# EAGLE design turntable (EAGLE 8.3.2)
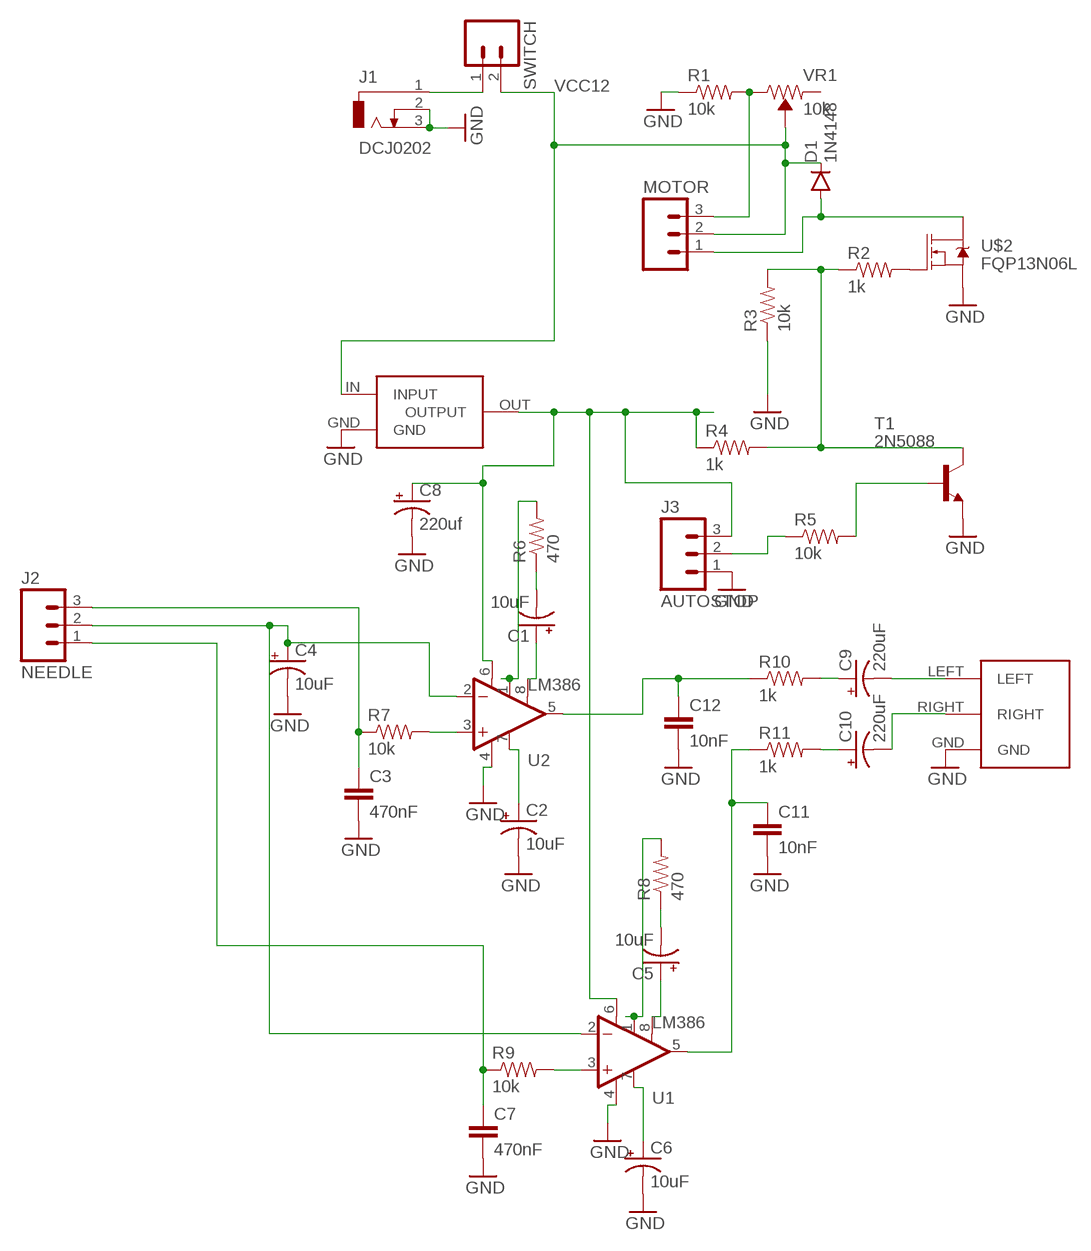
[diagram p0: schematic, sheet 1]

## Parts
C1  10uF  CPOL-USE5-5  [E5-5]
C2  10uF  CPOL-USE5-5  [E5-5]
C3  470nF  C15/8  [C15B8]
C4  10uF  CPOL-USE5-5  [E5-5]
C5  10uF  CPOL-USE5-5  [E5-5]
C6  10uF  CPOL-USE5-5  [E5-5]
C7  470nF  C15/8  [C15B8]
C8  220uf  CPOL-USTT5D10  [TT5D10]
C9  220uF  CPOL-USE5-5  [E5-5]
C10  220uF  CPOL-USE5-5  [E5-5]
C11  10nF  C5/2.5  [C5B2.5]
C12  10nF  C5/2.5  [C5B2.5]
D1  1N4148  DIODE1N4148  [DIODE-1N4148]
J1  DCJ0202  [DCJ0202]
J2  NEEDLE  M03PTH  [1X03]
J3  AUTOSTOP  M03PTH  [1X03]
MOTOR  M03PTH  [1X03]
R1  10k  RESISTORPTH-1/2W  [AXIAL-0.5]
R2  1k  RESISTORPTH-1/2W  [AXIAL-0.5]
R3  10k  RESISTORPTH-1/2W  [AXIAL-0.5]
R4  1k  RESISTORPTH-1/2W  [AXIAL-0.5]
R5  10k  RESISTORPTH-1/2W  [AXIAL-0.5]
R6  470  RESISTORPTH-1/2W  [AXIAL-0.5]
R7  10k  RESISTORPTH-1/2W  [AXIAL-0.5]
R8  470  RESISTORPTH-1/2W  [AXIAL-0.5]
R9  10k  RESISTORPTH-1/2W  [AXIAL-0.5]
R10  1k  RESISTORPTH-1/2W  [AXIAL-0.5]
R11  1k  RESISTORPTH-1/2W  [AXIAL-0.5]
SWITCH  M02PTH  [1X02]
T1  2N5088  [TO92]
U1  LM386  [DIP08]
U2  LM386  [DIP08]
U$1  LD1117  [78XXL]
U$2  FQP13N06L  [TO-220]
U$3  RCA  [RCA]
VR1  10k  TRIMPOT-PTH-10MM-KNOB-1/2W-10%  [TRIMPOT-PTH-3386U]

## Nets
GND: C2.- C3.2 C4.- C6.- C7.2 C8.- C11.2 C12.2 J1.2 J1.3 J3.1 R1.P$1 R3.P$1 T1.3(E) U1.4(V-) U2.4(V-) U$1.GND U$2.S U$3.GND
N$1: D1.A MOTOR.1 U$2.D
N$2: MOTOR.3 R1.P$2 VR1.3(CW)
N$3: R2.P$2 U$2.G
N$4: R2.P$1 R3.P$2 R4.P$2 T1.1(C)
N$5: C8.+ J3.3 R4.P$1 U1.6(V+) U2.6(V+) U$1.OUT(OUTPUT)
N$6: C1.- R6.P$1
N$7: J3.2 R5.P$1
N$8: R5.P$2 T1.2(B)
N$9: C1.+ U2.8(GAIN)
N$10: R6.P$2 U2.1(GAIN)
N$11: C2.+ U2.7(BP)
N$12: C4.+ J2.2 U1.2(-IN) U2.2(-IN)
N$13: C3.1 J2.3 R7.P$1
N$14: R7.P$2 U2.3(+IN)
N$15: C9.- U$3.LEFT
N$16: C9.+ R10.P$2
N$17: C5.- R8.P$1
N$18: C5.+ U1.8(GAIN)
N$19: R8.P$2 U1.1(GAIN)
N$20: C6.+ U1.7(BP)
N$21: C7.1 J2.1 R9.P$1
N$22: R9.P$2 U1.3(+IN)
N$23: C10.- U$3.RIGHT
N$24: C10.+ R11.P$2
N$25: C12.1 R10.P$1 U2.5(OUT)
N$26: C11.1 R11.P$1 U1.5(OUT)
N$27: J1.1 SWITCH.1
VCC12: D1.C MOTOR.2 SWITCH.2 U$1.IN(INPUT) VR1.2(WIPER)
Unconnected: VR1.1(CCW)

## Library data of the parts
C1 C2 C4-C6 C8-C10 = rcl:CPOL-US: POLARIZED CAPACITOR, American symbol
C3 C7 C11 C12 = capacitor-wima:C: CAPACITOR naming: grid - package width
D1 = SparkFun-DiscreteSemi:DIODE: Diode These are standard reverse protection diodes and small signal diodes. SMA package can handle up to about 1A. SOD-323 can handle about 200mA. What the SOD-323 package when ordering, there are some mfgs out there that are 5-pin packages.; PROD_ID: DIO-08378
J1 = con-jack:DCJ0202: DC POWER JACK Source: DCJ0202.pdf; OC_FARNELL: unknown; OC_NEWARK: unknown
J2 J3 MOTOR = SparkFun-Connectors:M03: Header 3 Standard 3-pin 0.1" header. Use with straight break away headers (SKU : PRT-00116), right angle break away headers (PRT-00553), swiss pins (PRT-00743), machine pins (PRT-00117), and female headers (PRT-00115). Molex polarized connector foot print use with SKU : PRT-08232 with associated crimp pins and housings.
R1-R11 = SparkFun-Resistors:RESISTOR: Resistor Basic schematic elements and footprints for 0603, 1206, and PTH resistors.
SWITCH = SparkFun-Connectors:M02: Standard 2-pin 0.1" header. Use with - straight break away headers ( PRT-00116) - right angle break away headers (PRT-00553) - swiss pins (PRT-00743) - machine pins (PRT-00117) - female headers (PRT-00115) Molex polarized connector foot print use with: PRT-08233 with associated crimp pins and housings. 2.54_SCREWTERM for use with PRT-10571. 3.5mm Screw Terminal footprints for PRT-08084 5mm Screw Terminal footprints for use with PRT-08432
T1 = transistor:2N5088: NPN TRANSISTOR
U1 U2 = SparkFun-AnalogIC:LM386: low voltage audio power amplifier
U$1 = turntable:LD1117
U$2 = turntable:FQP13N06L
U$3 = turntable:RCA
VR1 = SparkFun-Resistors:TRIMPOT: Trimming Potentiometer (Trimpot) Three-terminal potentiometers, with an adjustable wiper and two adjustable resistors. A pot can be used to create a configurable voltage divider, or as a variable resistor. "Trimpots" are a subset of potentiometers, usually intended for "set-and-forget" applications. They're often more delicate than standard potentiometers - rated for fewer turns. Variants PTH-KNOB - PTH Trimpot w/ finger-adjustable knob Trimpot 10K with Knob <https://www.sparkfun.com/products/9806> (COM-09806) Datasheet <http://www.sparkfun.com/datasheets/Components/General/TSR-3386.pdf> SMD-3MM-CLOSED-FRAME - SMD 3mm Square Closed-Frame Trimpot Used on e.g. EasyDriver - Stepper Motor Driver <https://www.sparkfun.com/products/12779> Datasheet <http://www.bitechnologies.com/pdfs/22.pdf> (22AR10KTR) SMD-5MM - SMD 5mm Square Closed-Frame Trimpot Used on e.g. IOIO-OTG - V2.2 <https://www.sparkfun.com/products/13613> Datasheet <http://www.vishay.com/docs/51008/ts53.pdf> (TS53YL502MR10) SMD-3MM-1/10W-25% - 3mm Square Open-Frame Trimpot Used on e.g. SparkFun Shapeoko <https://www.sparkfun.com/products/13899> Datasheet <http://www.bourns.com/docs/Product-Datasheets/TC33.pdf> (TC33X-2-103E); PROD_ID: RES-09730; SF_SKU: COM-09806

## Board
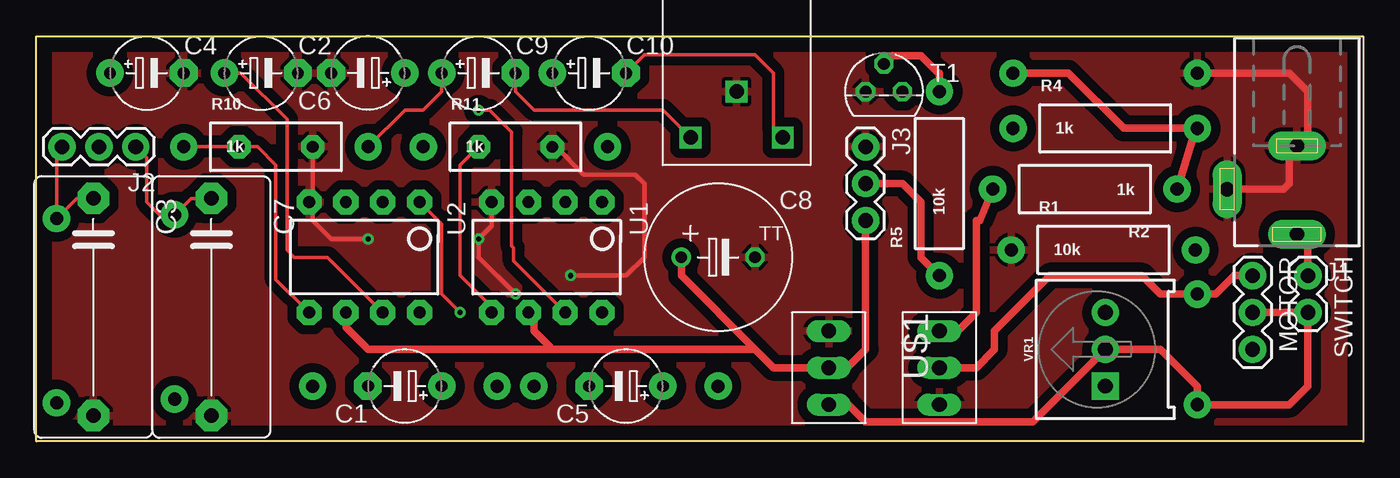
[diagram p1: board, top side]
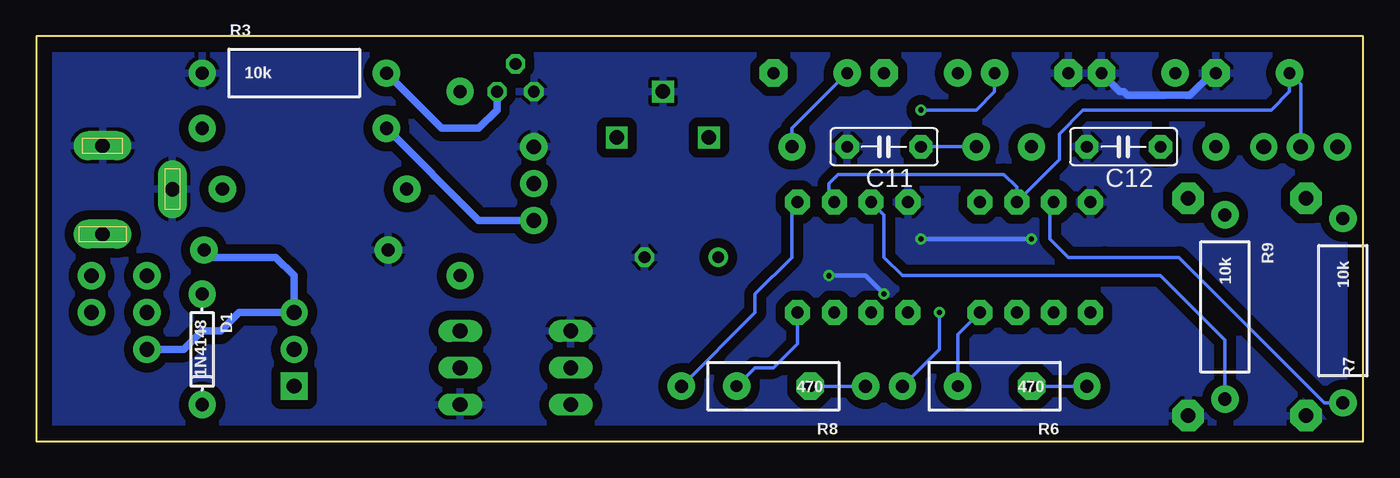
[diagram p2: board, bottom side, seen from below]

Size 91.44 x 27.94 mm. Coordinates in mm from the lower left corner, seen from the top.
Outline: 0,27.94 91.44,27.94 91.44,0 0,0 0,27.94
Copper layers (1*16): Top 0.035mm / dielectric 1.5mm / Bottom 0.035mm
Design rules "default": minimum track width 6mil, minimum drill 0.35mm, track to track 6mil, track to pad 6mil, pad to pad 6mil, via to via 6mil, smd to smd 6mil, copper to edge 40mil, drill to drill 6mil, minimum pad ring 10mil, minimum via ring 8mil, stop-mask expansion 4mil, vias tented up to drill 0mil, thermal gap 10mil

### Footprints (pad centres in the part's own frame; a part is rotated, then mirrored left to right if it is on the bottom)
E5-5 = drill 0.813 pad 1.905: + -2.54,0 | drill 0.813 pad 1.905 octagon: - 2.54,0
C15B8 = drill 1.016 pad 2.159 octagon: 1 -7.493,0; 2 7.493,0
TT5D10 = drill 0.813: + -2.54,0 | drill 0.813 octagon: - 2.54,0
C5B2.5 = drill 0.813 pad 1.6 octagon: 1 -2.54,0; 2 2.54,0
DIODE-1N4148 = drill 0.9 pad 1.88: A -3.81,0; C 3.81,0
DCJ0202 = drill 1 pad 2 long: 1 0,3.1; 2 4.8,0; 3 0,-3
1X03 = drill 1.016 pad 1.88: 1 0,0; 2 2.54,0; 3 5.08,0
AXIAL-0.5 = drill 0.9 pad 1.88: P$1 -6.35,0; P$2 6.35,0
1X02 = drill 1.016 pad 1.88: 1 0,0; 2 2.54,0
TO92 = drill 0.813 octagon: 1 1.27,0; 2 0,1.905; 3 -1.27,0
DIP08 = drill 0.813 pad 1.727 octagon: 1 -3.81,-3.81; 2 -1.27,-3.81; 3 1.27,-3.81; 4 3.81,-3.81; 5 3.81,3.81; 6 1.27,3.81; 7 -1.27,3.81; 8 -3.81,3.81
78XXL = drill 1.016 long: GND -2.54,-3.81; IN 2.54,-3.81; OUT 0,-3.81
TO-220 = drill 1.016 long: D 0,-3.81; G -2.54,-3.81; S 2.54,-3.81
RCA = drill 1 pad 1.27 square: GND 0,0; LEFT 3.175,3.175; RIGHT -3.175,3.175
TRIMPOT-PTH-3386U = drill 1.016 pad 1.88 square: 1 -2.54,-0.015 | drill 1.016 pad 1.88: 2 0,-0.015; 3 2.54,-0.015

### Placement (x,y rotation side)
C1  25.4,3.81 180 top
C2  15.49,25.4 0 top
C3  3.94,9.27 270 top
C4  7.62,25.4 0 top
C5  40.64,3.81 180 top
C6  22.86,25.4 180 top
C7  12.06,9.27 270 top
C8  46.99,12.7 0 top
C9  30.48,25.4 0 top
C10  38.1,25.4 0 top
C11  33.02,20.32 180 bottom
C12  16.51,20.32 180 bottom
D1  80.01,6.35 270 bottom
J1  86.87,17.4 180 top
J2  6.86,20.32 180 top
J3  57.15,20.32 270 top
MOTOR  83.82,11.43 270 top
R1  73.53,13.21 0 top
R2  72.26,17.4 180 top
R3  73.66,25.4 0 bottom
R4  73.66,21.59 0 top
R5  62.23,17.78 90 top
R6  25.4,3.81 180 bottom
R7  1.4,9.02 270 bottom
R8  40.64,3.81 180 bottom
R9  9.53,9.27 270 bottom
R10  16.51,20.32 0 top
R11  33.02,20.32 0 top
SWITCH  87.63,11.43 270 top
T1  58.42,24.13 0 top
U1  35.18,12.7 180 top
U2  22.61,12.7 180 top
U$1  58.42,5.08 270 top
U$2  66.04,5.08 270 top
U$3  48.26,24.13 180 top
VR1  73.66,6.35 90 top

### Tracks (layer width: path | path; a pad name or v marks a point on that pad's centre or on a via)
GND  (via drill 0.35)
  Top 0.305: C12.2 19.05,16.76 18.92,16.64 | 18.92,16.64 U2.4 | U1.4 31.37,14.86 v30.48,13.97 30.48,12.7 v33.02,10.16 | v22.86,13.97 20.32,13.97 19.05,15.24 19.05,16.51 18.92,16.64 | C11.2 35.81,20.32 37.72,18.41 41.27,18.41 41.91,17.78 41.91,12.7 40.64,11.43 v36.83,11.43
  Top 0.508: R3.P$1 86.36,25.4 87.63,24.13 87.63,20.32 87.55,20.4 J1.3 86.36,19.89 86.36,17.78 85.98,17.4 J1.2
  Bottom 0.305: v30.48,13.97 24.13,13.97 v22.86,13.97 | v36.83,11.43 34.29,11.43 v33.02,10.16
  Bottom 0.508: C4.- 10.41,25.4 11.94,23.88 16.26,23.88 16.51,24.13 16.76,24.13 C2.-
  pour Top (isolate 0.635): 0,27.94 91.44,27.94 91.44,0 0,0
  pour Bottom (isolate 0.635): 0,27.94 91.44,27.94 91.44,0 0,0
N$1
  Top 0.508: U$2.D 64.77,5.08 66.04,6.35 66.04,7.62 69.85,11.43 76.2,11.43 77.47,10.16 D1.A 81.28,10.16 82.55,11.43 MOTOR.1
N$2
  Bottom 0.508: R1.P$2 79.38,12.7 74.93,12.7 73.66,11.43 73.67,11.41 VR1.3 77.47,8.89 78.74,7.62 80.01,7.62 81.28,6.35 MOTOR.3
N$3
  Top 0.508: R2.P$2 65.02,15.24 64.77,15.24 64.77,8.89 63.5,7.62 U$2.G
N$4
  Top 0.508: R3.P$2 71.12,25.4 74.93,21.59 R4.P$2 79.88,21.46 R2.P$1
  Bottom 0.508: R3.P$2 63.5,21.59 60.96,21.59 59.69,22.86 T1.1
N$5
  Top 0.508: C8.+ 44.45,11.43 49.53,6.35 | 49.53,6.35 50.8,5.08 U$1.OUT 55.88,5.08 57.15,6.35 J3.3 | 49.53,6.35 35.56,6.35 | U1.6 34.29,8.51 34.29,7.62 35.56,6.35 | U2.6 21.34,7.87 22.86,6.35 35.56,6.35
  Bottom 0.508: J3.3 60.96,15.24 R4.P$1
N$6
  Bottom 0.254: R6.P$1 C1.-
N$7
  Top 0.508: R5.P$1 60.96,12.7 60.96,16.51 59.69,17.78 J3.2
N$8
  Top 0.508: T1.2 58.98,26.59 60.96,26.59 62.15,25.4 62.23,25.4 R5.P$2
N$9
  Bottom 0.254: U2.8 27.94,7.37 C1.+
N$10  (via drill 0.35)
  Top 0.254: U2.1 27.94,14.99 27.94,10.16 v29.21,8.89
  Bottom 0.254: R6.P$2 29.21,6.35 v29.21,8.89
N$11
  Top 0.254: U2.7 20.07,12.7 17.78,12.7 17.27,13.21 17.27,22.23 14.1,25.4 C2.+
N$12
  Bottom 0.254: J2.2 4.32,24.64 C4.+ 5.08,24.13 6.35,22.86 19.3,22.86 20.95,21.21 20.95,19.43 U2.2 23.88,17.53 24.77,18.41 36.2,18.41 36.83,17.78 36.83,16.89 U1.2
N$13
  Top 0.254: J2.3 1.4,19.94 R7.P$1 2.79,16.76 C3.1
N$14
  Bottom 0.254: U2.3 21.59,16.26 21.59,13.97 20.32,12.7 17.78,12.7 12.7,12.7 2.67,2.67 R7.P$2
N$15
  Top 0.254: U$3.LEFT 43.18,22.86 34.29,22.86 33.02,24.13 C9.-
N$16
  Top 0.254: C9.+ 27.94,24.13 26.67,22.86 25.4,22.86 R10.P$2
N$17
  Bottom 0.254: C5.- R8.P$1
N$18
  Bottom 0.254: C5.+ 41.91,5.08 40.64,5.08 38.99,6.73 U1.8
N$19
  Bottom 0.254: U1.1 39.37,16.13 39.37,12.7 41.91,10.16 41.91,8.89 R8.P$2
N$20  (via drill 0.35)
  Top 0.254: U1.7 32.89,12.45 32.89,13.34 32.77,13.46 32.77,21.34 31.24,22.86 v30.48,22.86
  Bottom 0.254: v30.48,22.86 26.67,22.86 25.4,24.13 C6.+
N$21
  Top 0.254: J2.1 7.62,19.56 7.62,16.51 8.51,15.62 R9.P$1 10.67,16.76 C7.1
N$22
  Bottom 0.254: U1.3 33.02,15.62 33.02,12.7 31.75,11.43 13.97,11.43 9.53,6.99 R9.P$2
N$23
  Top 0.254: U$3.RIGHT 50.8,21.59 50.8,25.4 49.53,26.67 41.91,26.67 C10.-
N$24
  Bottom 0.254: C10.+ 39.37,21.59 R11.P$2
N$25
  Top 0.254: R10.P$1 C12.1 15.24,20.32 16.51,19.05 16.51,11.18 U2.5
N$26
  Top 0.254: C11.1 29.21,19.05 29.21,11.43 31.37,9.27 U1.5
  Bottom 0.254: R11.P$1 C11.1
N$27
  Top 0.508: J1.1 87.63,13.54 SWITCH.1
VCC12
  Top 0.508: MOTOR.2 SWITCH.2 87.63,3.81 86.36,2.54 D1.C 80.01,3.81 77.47,6.35 VR1.2 68.67,1.35 57.15,1.35 55.96,2.54 U$1.IN